# EAGLE design eCog111_16ch_PWM_Servo (EAGLE 6.6.0)
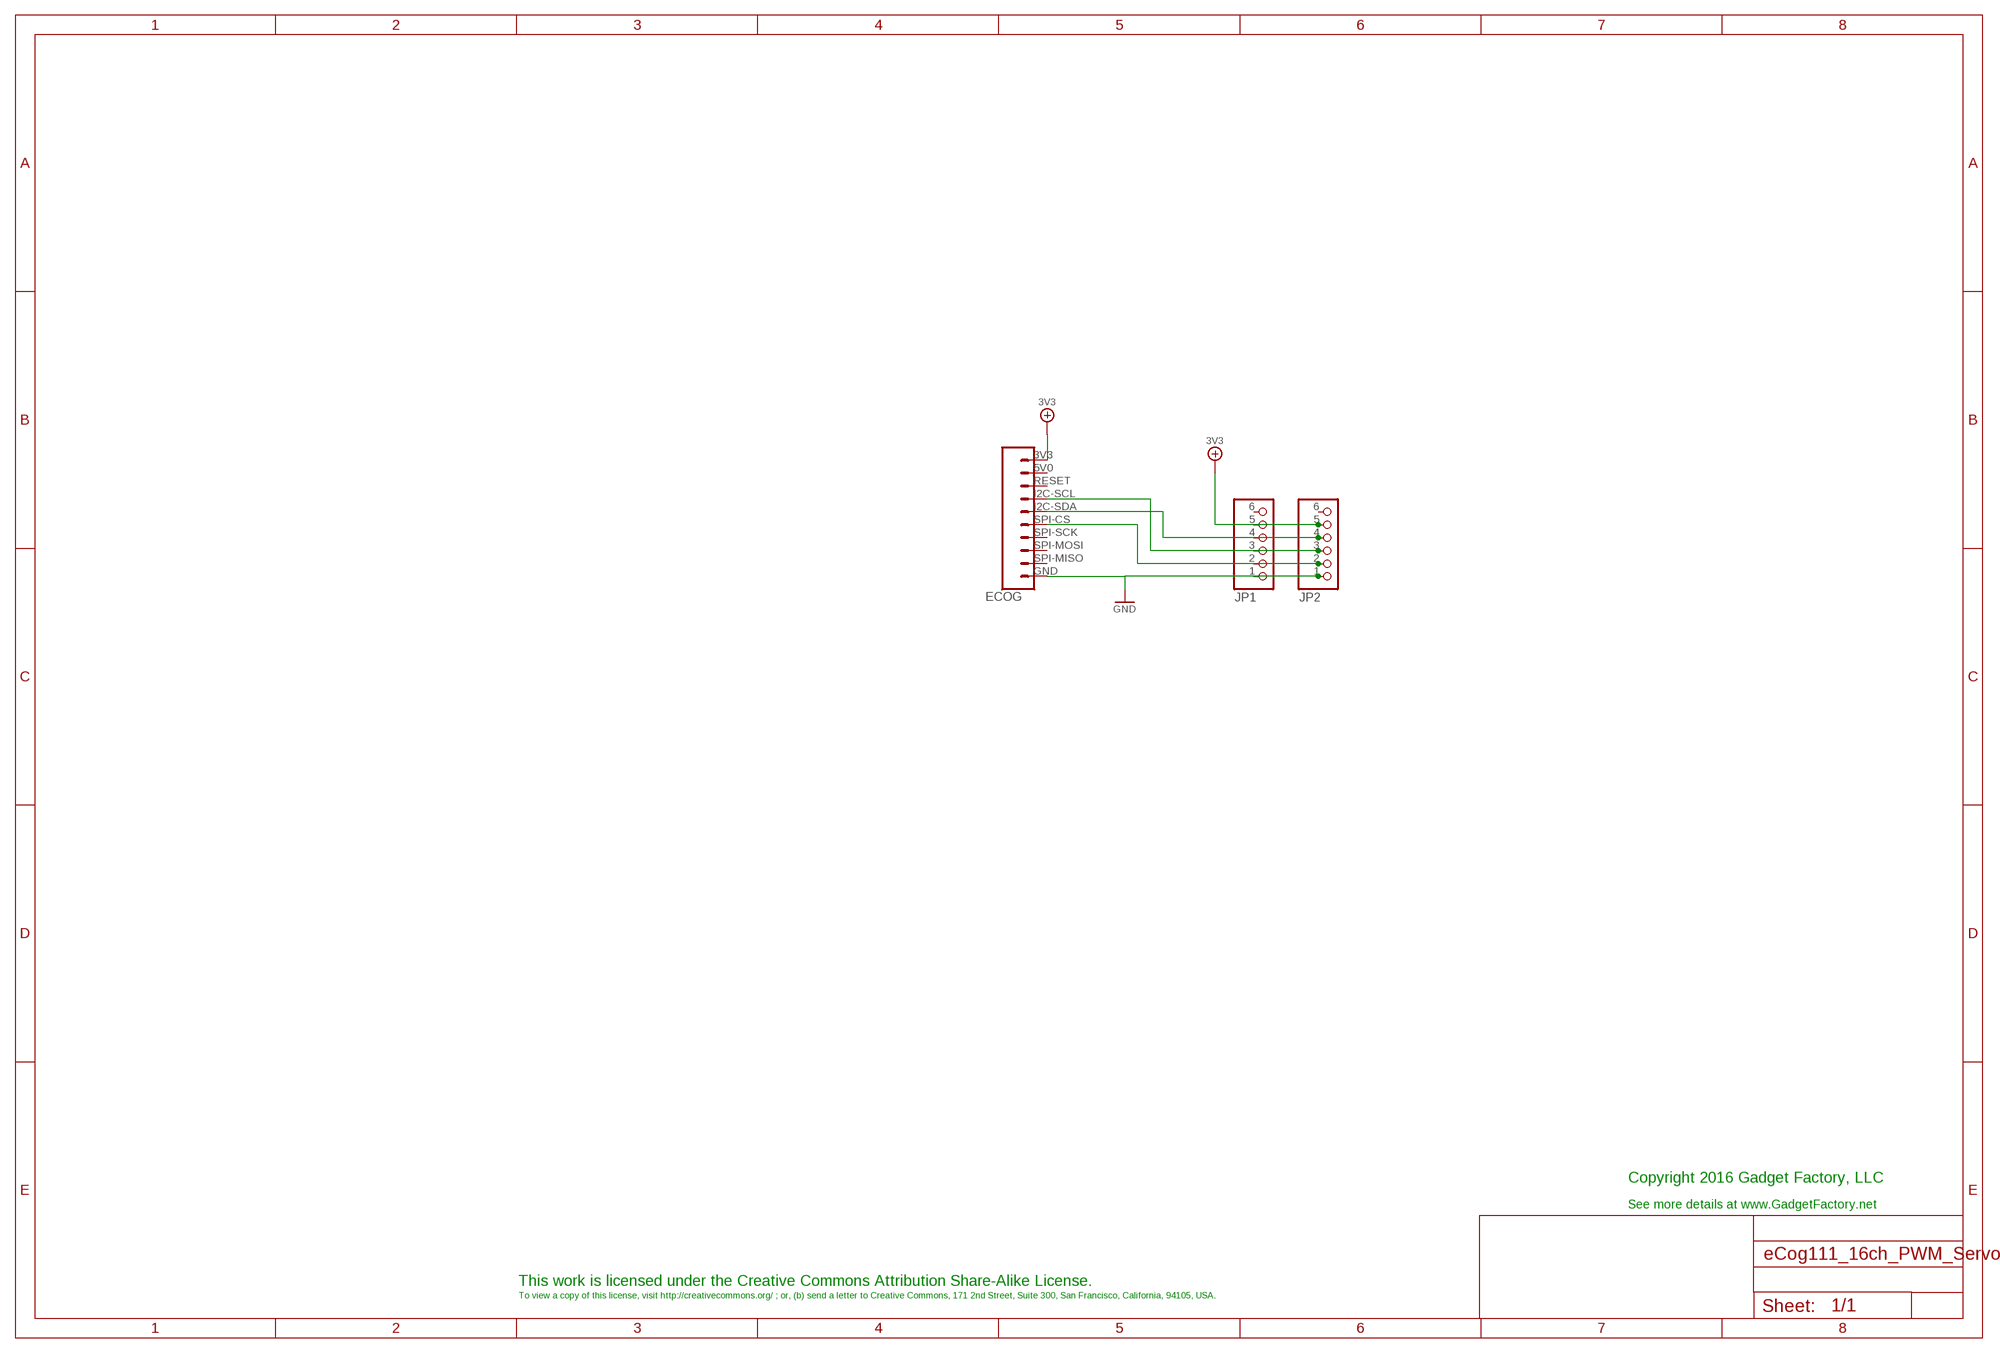
[diagram p0: schematic, sheet 1]

## Parts
ECOG  ECOG_BUSES_ROWTHROUGHHOLE  [ECOG_BUSES_TH]
JP1  PINHD-1X6  [1X06]
JP2  PINHD-1X6  [1X06]

## Nets
3V3: ECOG.3V3 JP1.5 JP2.5
GND: ECOG.GND JP1.1 JP2.1
N$1: ECOG.SPI-CS JP1.2 JP2.2
N$2: ECOG.I2C-SCL JP1.3 JP2.3
N$3: ECOG.I2C-SDA JP1.4 JP2.4
Unconnected: ECOG.5V0(RSV) ECOG.RESET(RSV) ECOG.SPI-MISO ECOG.SPI-MOSI ECOG.SPI-SCK JP1.6 JP2.6

## Notes on the sheet
- Copyright 2016 Gadget Factory, LLC
- See more details at www.GadgetFactory.net
- This work is licensed under the Creative Commons Attribution Share-Alike License.
- To view a copy of this license, visit http://creativecommons.org/ ; or, (b) send a letter to Creative Commons, 171 2nd Street, Suite 300, San Francisco, California, 94105, USA.

## Library data of the parts
ECOG = eCogs:ECOG_BUSES_ROW
JP1 JP2 = GadgetFactory:PINHD-1X6: PIN HEADER

## Board
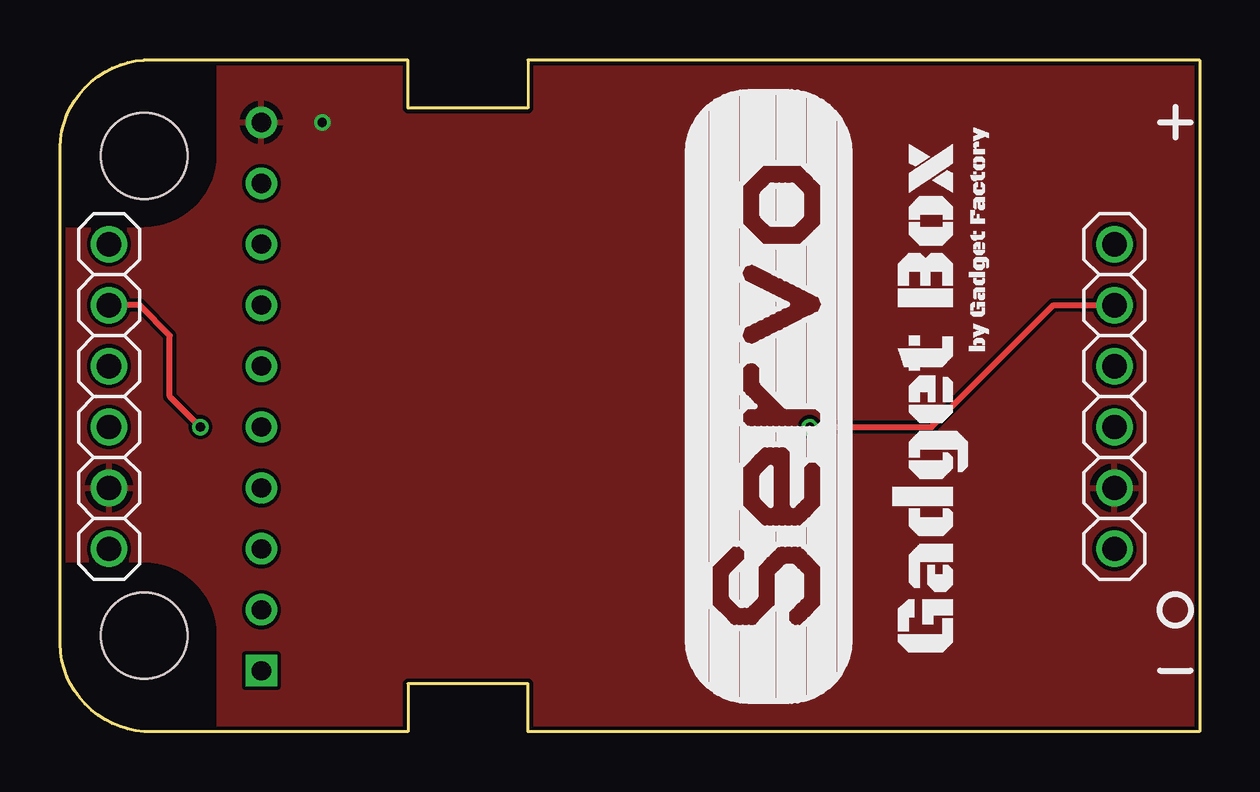
[diagram p1: board, top side]
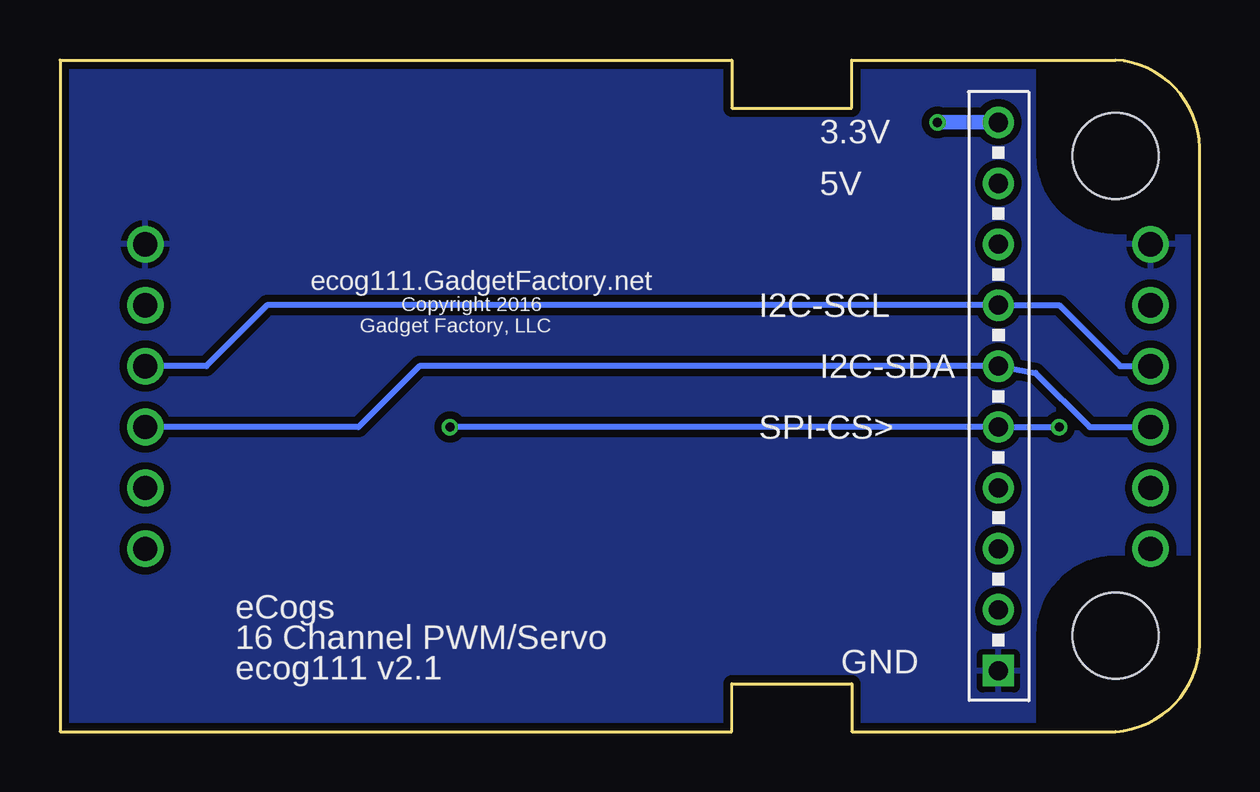
[diagram p2: board, bottom side, seen from below]

Size 47.51 x 28 mm. Coordinates in mm from the lower left corner, seen from the top.
Copper layers (1*16): Top 0.035mm / dielectric 1.5mm / Bottom 0.035mm
Design rules "hackvana": minimum track width 6mil, minimum drill 0.3mm, track to track 6mil, track to pad 6mil, pad to pad 6mil, via to via 6mil, smd to smd 0mil, copper to edge 6mil, drill to drill 6mil, minimum pad ring 10mil, minimum via ring 6mil, stop-mask expansion 2mil, vias tented up to drill 100mil, thermal gap 10mil

### Footprints (pad centres in the part's own frame; a part is rotated, then mirrored left to right if it is on the bottom)
ECOG_BUSES_TH = drill 0.8: 3V3 8.89,25.4; 5V0 8.89,22.86; I2C-SCL 8.89,17.78; I2C-SDA 8.89,15.24; RESET 8.89,20.32; SPI-CS 8.89,12.7; SPI-MISO 8.89,5.08; SPI-MOSI 8.89,7.62; SPI-SCK 8.89,10.16 | drill 0.8 square: GND 8.89,2.54 | hole 3.6: 4.004,24.003; 4.004,4.003
1X06 = drill 1.016: 1 -6.35,0; 2 -3.81,0; 3 -1.27,0; 4 1.27,0; 5 3.81,0; 6 6.35,0

### Placement (x,y rotation side)
ECOG  -0.5,0 0 top
JP1  43.95,13.97 270 top
JP2  2.04,13.97 270 top
U$2  [GADGETBOX_SMALL]  36.33,13.97 90 top

### Tracks (layer width: path | path; a pad name or v marks a point on that pad's centre or on a via)
3V3  (via drill 0.38)
  Bottom 0.61: ECOG.3V3 v10.93,25.4
  pour Top: -1.5,29 48.5,29 48.5,-1 -1.5,-1
GND
  pour Bottom (isolate 0.305): -2.5,30 49.5,30 49.5,-2 -2.5,-2
N$1  (via drill 0.38)
  Top 0.254: v31.25,12.7 36.33,12.7 41.41,17.78 JP1.2 | v5.85,12.7 4.58,13.97 4.58,16.51 3.31,17.78 JP2.2
  Bottom 0.254: v31.25,12.7 ECOG.SPI-CS v5.85,12.7
N$2
  Bottom 0.254: JP1.3 41.41,15.24 38.87,17.78 ECOG.I2C-SCL 5.85,17.78 3.31,15.24 JP2.3
N$3
  Bottom 0.254: JP1.4 35.06,12.7 32.52,15.24 ECOG.I2C-SDA 6.84,14.96 4.58,12.7 JP2.4

### Text on the board
bPlace: 3.3V | 5V | Copyright 2016 | ecog111.GadgetFactory.net | I2C-SCL | Gadget Factory, LLC | I2C-SDA | SPI-CS> | eCogs | 16 Channel PWM/Servo | GND | ecog111 v2.1